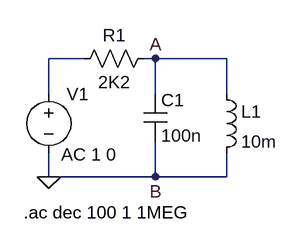
[diagram p0: schematic Apartado a.asc]
Apartado a.asc, the LTspice schematic file:
Version 4
SHEET 1 880 680
WIRE 240 96 192 96
WIRE 336 96 320 96
WIRE 432 96 336 96
WIRE 192 144 192 96
WIRE 336 144 336 96
WIRE 432 144 432 96
WIRE 192 256 192 224
WIRE 336 256 336 208
WIRE 336 256 192 256
WIRE 432 256 432 224
WIRE 432 256 336 256
FLAG 192 256 0
FLAG 336 96 A
FLAG 336 256 B
SYMBOL res 336 80 R90
WINDOW 0 0 56 VBottom 2
WINDOW 3 32 56 VTop 2
SYMATTR InstName R1
SYMATTR Value 2K2
SYMBOL ind 416 128 R0
SYMATTR InstName L1
SYMATTR Value 10m
SYMBOL cap 320 144 R0
SYMATTR InstName C1
SYMATTR Value 100n
SYMBOL voltage 192 128 R0
WINDOW 123 17 98 Left 2
WINDOW 39 0 0 Left 0
SYMATTR InstName V1
SYMATTR Value ""
SYMATTR Value2 AC 1 0
TEXT 158 304 Left 2 !.ac dec 100 1 1MEG

The netlist it stands for:
* Apartado a.asc
R1 A N001 2K2
L1 A 0 10m
C1 A 0 100n
V1 N001 0 AC 1 0
.ac dec 100 1 1MEG
.backanno
.end